# EAGLE schematic Instructables 36+12 (EAGLE 9.0.1)
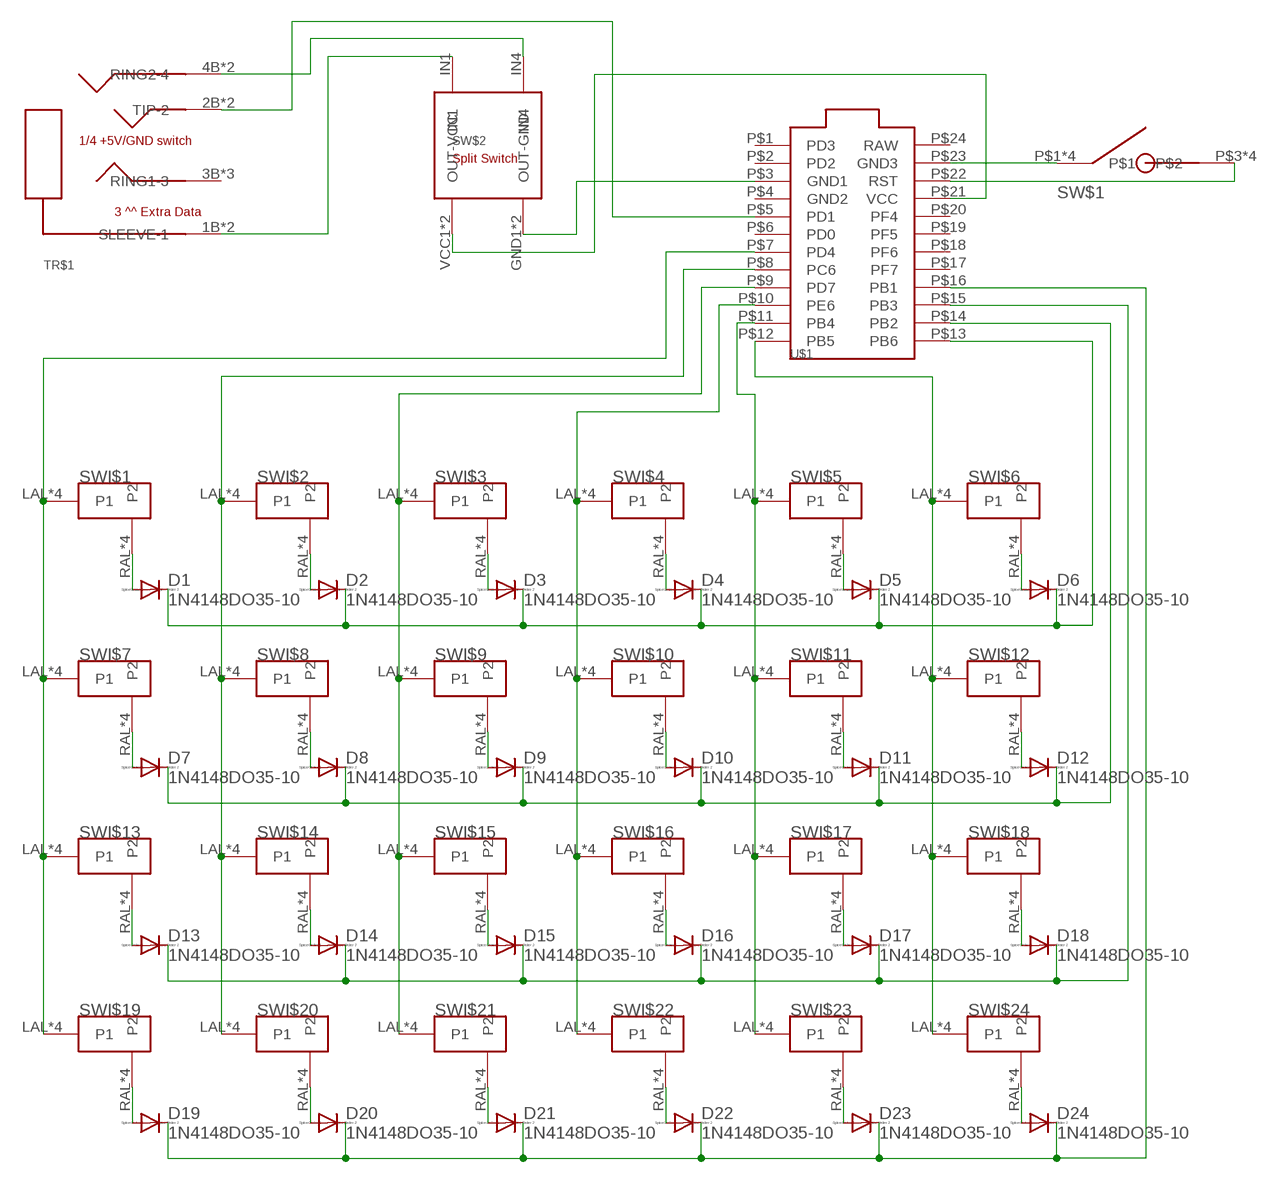
[diagram p0: schematic, sheet 1]

## Parts
D1  1N4148DO35-10  [DO35-10]
D2  1N4148DO35-10  [DO35-10]
D3  1N4148DO35-10  [DO35-10]
D4  1N4148DO35-10  [DO35-10]
D5  1N4148DO35-10  [DO35-10]
D6  1N4148DO35-10  [DO35-10]
D7  1N4148DO35-10  [DO35-10]
D8  1N4148DO35-10  [DO35-10]
D9  1N4148DO35-10  [DO35-10]
D10  1N4148DO35-10  [DO35-10]
D11  1N4148DO35-10  [DO35-10]
D12  1N4148DO35-10  [DO35-10]
D13  1N4148DO35-10  [DO35-10]
D14  1N4148DO35-10  [DO35-10]
D15  1N4148DO35-10  [DO35-10]
D16  1N4148DO35-10  [DO35-10]
D17  1N4148DO35-10  [DO35-10]
D18  1N4148DO35-10  [DO35-10]
D19  1N4148DO35-10  [DO35-10]
D20  1N4148DO35-10  [DO35-10]
D21  1N4148DO35-10  [DO35-10]
D22  1N4148DO35-10  [DO35-10]
D23  1N4148DO35-10  [DO35-10]
D24  1N4148DO35-10  [DO35-10]
SW$1  RSTSWSMD  [FLATSWT]
SW$2  TRANSFERHOLEY  [TRANSFER]
SWI$1  MX/ALPSDOUBLESIDED  [DOUBLED_MX/ALPS]
SWI$2  MX/ALPSDOUBLESIDED  [DOUBLED_MX/ALPS]
SWI$3  MX/ALPSDOUBLESIDED  [DOUBLED_MX/ALPS]
SWI$4  MX/ALPSDOUBLESIDED  [DOUBLED_MX/ALPS]
SWI$5  MX/ALPSDOUBLESIDED  [DOUBLED_MX/ALPS]
SWI$6  MX/ALPSDOUBLESIDED  [DOUBLED_MX/ALPS]
SWI$7  MX/ALPSDOUBLESIDED  [DOUBLED_MX/ALPS]
SWI$8  MX/ALPSDOUBLESIDED  [DOUBLED_MX/ALPS]
SWI$9  MX/ALPSDOUBLESIDED  [DOUBLED_MX/ALPS]
SWI$10  MX/ALPSDOUBLESIDED  [DOUBLED_MX/ALPS]
SWI$11  MX/ALPSDOUBLESIDED  [DOUBLED_MX/ALPS]
SWI$12  MX/ALPSDOUBLESIDED  [DOUBLED_MX/ALPS]
SWI$13  MX/ALPSDOUBLESIDED  [DOUBLED_MX/ALPS]
SWI$14  MX/ALPSDOUBLESIDED  [DOUBLED_MX/ALPS]
SWI$15  MX/ALPSDOUBLESIDED  [DOUBLED_MX/ALPS]
SWI$16  MX/ALPSDOUBLESIDED  [DOUBLED_MX/ALPS]
SWI$17  MX/ALPSDOUBLESIDED  [DOUBLED_MX/ALPS]
SWI$18  MX/ALPSDOUBLESIDED  [DOUBLED_MX/ALPS]
SWI$19  MX/ALPSDOUBLESIDED  [DOUBLED_MX/ALPS]
SWI$20  MX/ALPSDOUBLESIDED  [DOUBLED_MX/ALPS]
SWI$21  MX/ALPSDOUBLESIDED  [DOUBLED_MX/ALPS]
SWI$22  MX/ALPSDOUBLESIDED  [DOUBLED_MX/ALPS]
SWI$23  MX/ALPSDOUBLESIDED  [DOUBLED_MX/ALPS]
SWI$24  MX/ALPSDOUBLESIDED  [DOUBLED_MX/ALPS]
TR$1  TRRSJACK  [TRRSJACK]
U$1  PROMICROUNDER  [PROMICRO_UNDER]

## Nets
N$1: D13.A SWI$13.RAL(P2) SWI$13.RAR(P2) SWI$13.RCL(P2) SWI$13.RCR(P2)
N$2: D1.A SWI$1.RAL(P2) SWI$1.RAR(P2) SWI$1.RCL(P2) SWI$1.RCR(P2)
N$3: D2.A SWI$2.RAL(P2) SWI$2.RAR(P2) SWI$2.RCL(P2) SWI$2.RCR(P2)
N$4: D3.A SWI$3.RAL(P2) SWI$3.RAR(P2) SWI$3.RCL(P2) SWI$3.RCR(P2)
N$5: D4.A SWI$4.RAL(P2) SWI$4.RAR(P2) SWI$4.RCL(P2) SWI$4.RCR(P2)
N$6: D5.A SWI$5.RAL(P2) SWI$5.RAR(P2) SWI$5.RCL(P2) SWI$5.RCR(P2)
N$7: D6.A SWI$6.RAL(P2) SWI$6.RAR(P2) SWI$6.RCL(P2) SWI$6.RCR(P2)
N$8: D7.A SWI$7.RAL(P2) SWI$7.RAR(P2) SWI$7.RCL(P2) SWI$7.RCR(P2)
N$9: D8.A SWI$8.RAL(P2) SWI$8.RAR(P2) SWI$8.RCL(P2) SWI$8.RCR(P2)
N$10: D9.A SWI$9.RAL(P2) SWI$9.RAR(P2) SWI$9.RCL(P2) SWI$9.RCR(P2)
N$11: D10.A SWI$10.RAL(P2) SWI$10.RAR(P2) SWI$10.RCL(P2) SWI$10.RCR(P2)
N$12: D11.A SWI$11.RAL(P2) SWI$11.RAR(P2) SWI$11.RCL(P2) SWI$11.RCR(P2)
N$13: D12.A SWI$12.RAL(P2) SWI$12.RAR(P2) SWI$12.RCL(P2) SWI$12.RCR(P2)
N$14: D14.A SWI$14.RAL(P2) SWI$14.RAR(P2) SWI$14.RCL(P2) SWI$14.RCR(P2)
N$15: D15.A SWI$15.RAL(P2) SWI$15.RAR(P2) SWI$15.RCL(P2) SWI$15.RCR(P2)
N$16: D16.A SWI$16.RAL(P2) SWI$16.RAR(P2) SWI$16.RCL(P2) SWI$16.RCR(P2)
N$17: D17.A SWI$17.RAL(P2) SWI$17.RAR(P2) SWI$17.RCL(P2) SWI$17.RCR(P2)
N$18: D18.A SWI$18.RAL(P2) SWI$18.RAR(P2) SWI$18.RCL(P2) SWI$18.RCR(P2)
N$19: D19.A SWI$19.RAL(P2) SWI$19.RAR(P2) SWI$19.RCL(P2) SWI$19.RCR(P2)
N$20: D20.A SWI$20.RAL(P2) SWI$20.RAR(P2) SWI$20.RCL(P2) SWI$20.RCR(P2)
N$21: D21.A SWI$21.RAL(P2) SWI$21.RAR(P2) SWI$21.RCL(P2) SWI$21.RCR(P2)
N$22: D22.A SWI$22.RAL(P2) SWI$22.RAR(P2) SWI$22.RCL(P2) SWI$22.RCR(P2)
N$23: D23.A SWI$23.RAL(P2) SWI$23.RAR(P2) SWI$23.RCL(P2) SWI$23.RCR(P2)
N$24: D24.A SWI$24.RAL(P2) SWI$24.RAR(P2) SWI$24.RCL(P2) SWI$24.RCR(P2)
N$25: D1.C D2.C D3.C D4.C D5.C D6.C U$1.P$13(PB6)
N$26: D7.C D8.C D9.C D10.C D11.C D12.C U$1.P$14(PB2)
N$27: D13.C D14.C D15.C D16.C D17.C D18.C U$1.P$15(PB3)
N$28: D19.C D20.C D21.C D22.C D23.C D24.C U$1.P$16(PB1)
N$29: SWI$1.LAL(P1) SWI$1.LAR(P1) SWI$1.LCL(P1) SWI$1.LCR(P1) SWI$7.LAL(P1) SWI$7.LAR(P1) SWI$7.LCL(P1) SWI$7.LCR(P1) SWI$13.LAL(P1) SWI$13.LAR(P1) SWI$13.LCL(P1) SWI$13.LCR(P1) SWI$19.LAL(P1) SWI$19.LAR(P1) SWI$19.LCL(P1) SWI$19.LCR(P1) U$1.P$7(PD4)
N$30: SWI$2.LAL(P1) SWI$2.LAR(P1) SWI$2.LCL(P1) SWI$2.LCR(P1) SWI$8.LAL(P1) SWI$8.LAR(P1) SWI$8.LCL(P1) SWI$8.LCR(P1) SWI$14.LAL(P1) SWI$14.LAR(P1) SWI$14.LCL(P1) SWI$14.LCR(P1) SWI$20.LAL(P1) SWI$20.LAR(P1) SWI$20.LCL(P1) SWI$20.LCR(P1) U$1.P$8(PC6)
N$31: SWI$3.LAL(P1) SWI$3.LAR(P1) SWI$3.LCL(P1) SWI$3.LCR(P1) SWI$9.LAL(P1) SWI$9.LAR(P1) SWI$9.LCL(P1) SWI$9.LCR(P1) SWI$15.LAL(P1) SWI$15.LAR(P1) SWI$15.LCL(P1) SWI$15.LCR(P1) SWI$21.LAL(P1) SWI$21.LAR(P1) SWI$21.LCL(P1) SWI$21.LCR(P1) U$1.P$9(PD7)
N$32: SWI$4.LAL(P1) SWI$4.LAR(P1) SWI$4.LCL(P1) SWI$4.LCR(P1) SWI$10.LAL(P1) SWI$10.LAR(P1) SWI$10.LCL(P1) SWI$10.LCR(P1) SWI$16.LAL(P1) SWI$16.LAR(P1) SWI$16.LCL(P1) SWI$16.LCR(P1) SWI$22.LAL(P1) SWI$22.LAR(P1) SWI$22.LCL(P1) SWI$22.LCR(P1) U$1.P$10(PE6)
N$33: SWI$5.LAL(P1) SWI$5.LAR(P1) SWI$5.LCL(P1) SWI$5.LCR(P1) SWI$11.LAL(P1) SWI$11.LAR(P1) SWI$11.LCL(P1) SWI$11.LCR(P1) SWI$17.LAL(P1) SWI$17.LAR(P1) SWI$17.LCL(P1) SWI$17.LCR(P1) SWI$23.LAL(P1) SWI$23.LAR(P1) SWI$23.LCL(P1) SWI$23.LCR(P1) U$1.P$11(PB4)
N$34: SWI$6.LAL(P1) SWI$6.LAR(P1) SWI$6.LCL(P1) SWI$6.LCR(P1) SWI$12.LAL(P1) SWI$12.LAR(P1) SWI$12.LCL(P1) SWI$12.LCR(P1) SWI$18.LAL(P1) SWI$18.LAR(P1) SWI$18.LCL(P1) SWI$18.LCR(P1) SWI$24.LAL(P1) SWI$24.LAR(P1) SWI$24.LCL(P1) SWI$24.LCR(P1) U$1.P$12(PB5)
N$35: SW$1.P$1 SW$1.P$2 SW$1.P$5 SW$1.P$6 U$1.P$23(GND3)
N$36: SW$1.P$3 SW$1.P$4 SW$1.P$7 SW$1.P$8 U$1.P$22(RST)
N$37: SW$2.GND1(OUT-GND) SW$2.GND2(OUT-GND) U$1.P$3(GND1)
N$38: SW$2.VCC1(OUT-VCC) SW$2.VCC2(OUT-VCC) U$1.P$21(VCC)
N$39: SW$2.IN1 TR$1.1B(SLEEVE-1) TR$1.1T(SLEEVE-1)
N$40: SW$2.IN4 TR$1.4B(RING2-4) TR$1.4T(RING2-4)
N$41: TR$1.2B(TIP-2) TR$1.2T(TIP-2) U$1.P$5(PD1)
Unconnected: TR$1.3B(RING1-3) TR$1.3T(RING1-3) TR$1.EXTRA_DATA(RING1-3) U$1.P$1(PD3) U$1.P$2(PD2) U$1.P$4(GND2) U$1.P$6(PD0) U$1.P$17(PF7) U$1.P$18(PF6) U$1.P$19(PF5) U$1.P$20(PF4) U$1.P$24(RAW)

## Library data of the parts
D1-D24 = diode:1N4148: DIODE high speed (Philips)
SW$1 = Keys:RSTSW
SW$2 = Keys:TRANSFER
SWI$1-SWI$24 = Keys:MX/ALPS
TR$1 = Keys:TRRSJACK
U$1 = Keys:PROMICRO